# EAGLE design HSNetmeter-simple-v1.1 (EAGLE 8.6.0)
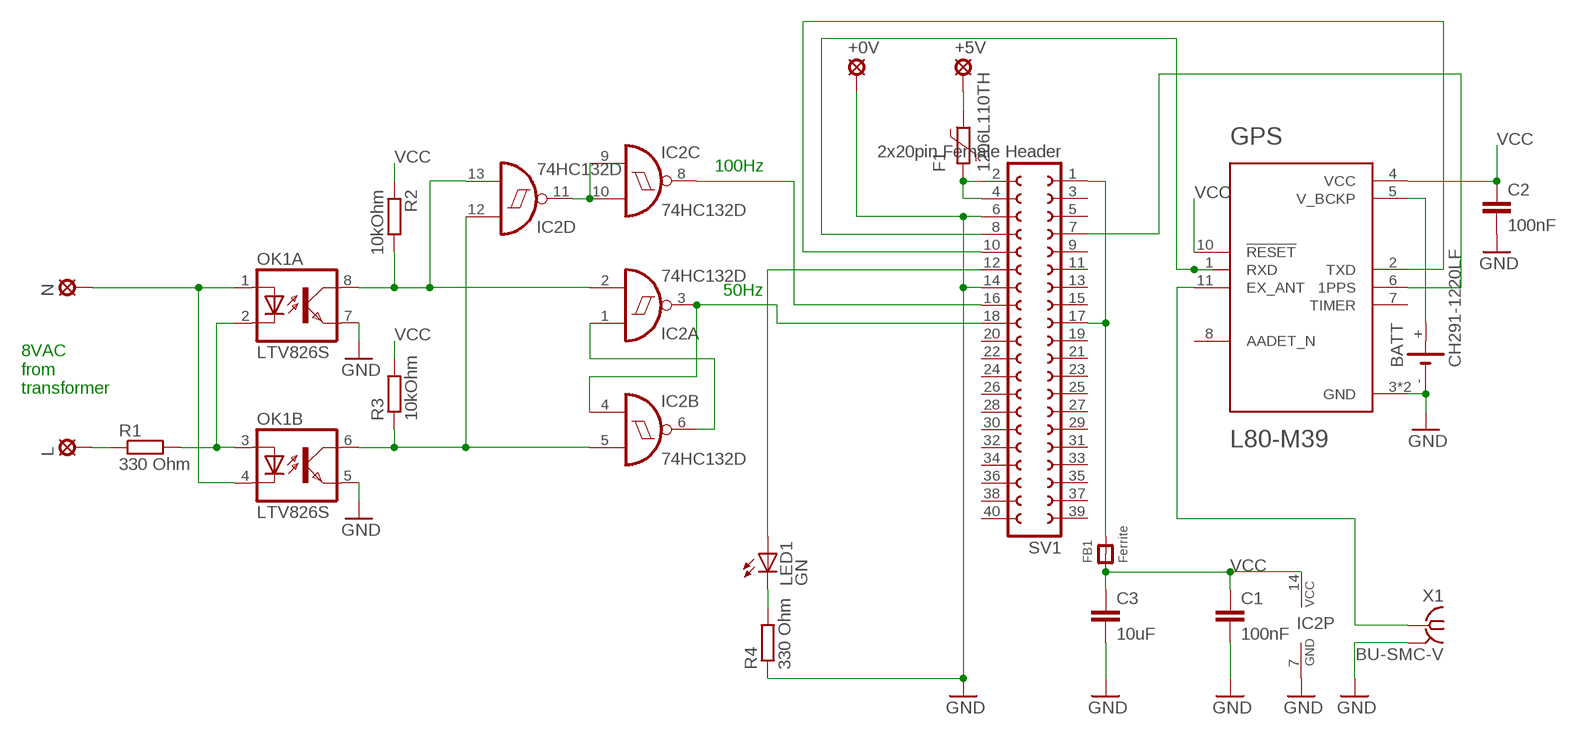
[diagram p0: schematic, sheet 1]

## Parts
+0V  LSP11  [LSP11]
+5V  LSP11  [LSP11]
BATT  CH291-1220LF  [CH291-1220LF]
C1  100nF  C-EUC0805  [C0805]
C2  100nF  C-EUC0805  [C0805]
C3  10uF  C-EUC1206  [C1206]
F1  1206L110TH  [1206L]
FB1  Ferrite  FERRITE0805  [0805]
GPS  L80-M39  [QUECTEL_L80-M39]
IC2  74HC132D  [SO14]
L  LSP11  [LSP11]
LED1  GN  LED3MM  [LED3MM]
N  LSP11  [LSP11]
OK1  LTV826S  [DIL8-SMD]
R1  330 Ohm  R-EU_M0805  [M0805]
R2  10kOhm  R-EU_M0805  [M0805]
R3  10kOhm  R-EU_M0805  [M0805]
R4  330 Ohm  R-EU_M0805  [M0805]
SV1  2x20pin Female Header  FE20-2  [FE20-2]
X1  BU-SMC-V  [BU-SMC-V]

## Nets
+3.3V: FB1.2 SV1.1 SV1.17
GND: +0V.MP BATT.- C1.2 C2.2 C3.2 GPS.3(GND) GPS.12(GND) IC2.7(P:GND) OK1.5(B:EMIT) OK1.7(A:EMIT) R4.1 SV1.6 SV1.14 X1.2 X1.3 X1.4 X1.5
N$1: IC2.8(C:O) SV1.16
N$2: L.MP R1.1
N$3: LED1.K(C) R4.2
N$4: N.MP OK1.1(A:A) OK1.4(B:C)
N$5: F1.2 SV1.2 SV1.4
N$6: +5V.MP F1.1
N$7: LED1.A SV1.12
N$8: GPS.6(1PPS) SV1.7
N$9: OK1.2(A:C) OK1.3(B:A) R1.2
N$10: GPS.1(RXD) SV1.8
N$11: GPS.2(TXD) SV1.10
N$12: IC2.2(A:I1) IC2.13(D:I1) OK1.8(A:COL) R2.2
N$13: IC2.5(B:I1) IC2.12(D:I0) OK1.6(B:COL) R3.1
N$14: IC2.3(A:O) IC2.4(B:I0) SV1.18
N$15: IC2.1(A:I0) IC2.6(B:O)
N$16: IC2.9(C:I0) IC2.10(C:I1) IC2.11(D:O)
N$17: GPS.11(EX_ANT) X1.1
N$18: BATT.+ GPS.5(V_BCKP)
VCC: C1.1 C2.1 C3.1 FB1.1 GPS.4(VCC) GPS.10(!RESET) IC2.14(P:VCC) R2.1 R3.2
Unconnected: GPS.7(TIMER) GPS.8(AADET_N) SV1.3 SV1.5 SV1.9 SV1.11 SV1.13 SV1.15 SV1.19 SV1.20 SV1.21 SV1.22 SV1.23 SV1.24 SV1.25 SV1.26 SV1.27 SV1.28 SV1.29 SV1.30 SV1.31 SV1.32 SV1.33 SV1.34 SV1.35 SV1.36 SV1.37 SV1.38 SV1.39 SV1.40

## Notes on the sheet
- 100Hz
- 50Hz
- 8VAC 
  from 
  transformer

## Library data of the parts
+0V +5V L N = solpad:LSP11: SOLDER PAD drill 1.1 mm
BATT = battery:CH291-1220LF: Battery Holder, SMT, 12mm multicomp PART NO. CH291-1220LF Source: Data sheet <http://www.farnell.com/datasheets/1505860.pdf>
C1-C3 = resistor:C-EU: CAPACITOR, European symbol
F1 = polyfuse-smd_10:?: Polyfuse Resettable PTC Source: http://www.littelfuse.com/products/resettable-ptcs.aspx; MF: Littelfuse; MPN: 1206L110TH; OC_FARNELL: 2383294; OC_NEWARK: 64R8194
FB1 = microbuilder:FERRITE: Ferrite Bead 0603 MMZ1608B121C - 120 Ohm @ 100MHz, 600mA, 0.15 Ohm DC Resistance - Digikey: 445-2164-1-ND BK1608HW121-T - 120 Ohm, 600mA Ferrite Chip - Digikey: 587-1876-2-ND 0805 HZ0805B272R-10 - 2.7K Ohm @ 100MHz, 200mA, 0.8 Ohm DC Resistance - Digikey: 240-2504-1-ND (see also Murata BLM21BD272SN1L) MMZ2012Y152B - 1.5K Ohm @ 100MHz, 500mA, 0.4 Ohm DC Resistance - Digikey: 445-1560-1-ND - Mainly for high frequency (80-400MHz) MMZ2012R102A - 1K Ohm @ 100MHz, 500mA, 0.3 Ohm DC Resistance - Digikey: 445-1555-2-ND - More general purpose (10-200MHz)
GPS = L80-M39:L80-M39: GPS Receiver 1575.42MHz 3.3V 12-Pin; AVAILABILITY: Bad; DESCRIPTION: GPS Receiver 1575.42MHz 3.3V 12-Pin; MF: Quectel; MP: L80-M39; PACKAGE: None; PRICE: 8.97 USD
IC2 = 74xx-eu:74*132: Quad 2-input NAND schmitt trigger
LED1 = led:LED: LED OSRAM: - CHIPLED LG R971, LG N971, LY N971, LG Q971, LY Q971, LO R971, LY R971 LH N974, LH R974 LS Q976, LO Q976, LY Q976 LO Q996 - Hyper CHIPLED LW Q18S LB Q993, LB Q99A, LB R99A - SideLED LS A670, LO A670, LY A670, LG A670, LP A670 LB A673, LV A673, LT A673, LW A673 LH A674 LY A675 LS A676, LA A676, LO A676, LY A676, LW A676 LS A679, LY A679, LG A679 - Hyper Micro SIDELED® LS Y876, LA Y876, LO Y876, LY Y876 LT Y87S - SmartLED LW L88C, LW L88S LB L89C, LB L89S, LG L890 LS L89K, LO L89K, LY L89K LS L896, LA L896, LO L896, LY L896 - TOPLED LS T670, LO T670, LY T670, LG T670, LP T670 LSG T670, LSP T670, LSY T670, LOP T670, LYG T670 LG T671, LOG T671, LSG T671 LB T673, LV T673, LT T673, LW T673 LH T674 LS T676, LA T676, LO T676, LY T676, LB T676, LH T676, LSB T676, LW T676 LB T67C, LV T67C, LT T67C, LS T67K, LO T67K, LY T67K, LW E67C LS E67B, LA E67B, LO E67B, LY E67B, LB E67C, LV E67C, LT E67C LW T67C LS T679, LY T679, LG T679 LS T770, LO T770, LY T770, LG T770, LP T770 LB T773, LV T773, LT T773, LW T773 LH T774 LS E675, LA E675, LY E675, LS T675 LS T776, LA T776, LO T776, LY T776, LB T776 LHGB T686 LT T68C, LB T68C - Hyper Mini TOPLED® LB M676 - Mini TOPLED Santana® LG M470 LS M47K, LO M47K, LY M47K Source: http://www.osram.convergy.de LUXEON: - LUMILED® LXK2-PW12-R00, LXK2-PW12-S00, LXK2-PW14-U00, LXK2-PW14-V00 LXK2-PM12-R00, LXK2-PM12-S00, LXK2-PM14-U00 LXK2-PE12-Q00, LXK2-PE12-R00, LXK2-PE12-S00, LXK2-PE14-T00, LXK2-PE14-U00 LXK2-PB12-K00, LXK2-PB12-L00, LXK2-PB12-M00, LXK2-PB14-N00, LXK2-PB14-P00, LXK2-PB14-Q00 LXK2-PR12-L00, LXK2-PR12-M00, LXK2-PR14-Q00, LXK2-PR14-R00 LXK2-PD12-Q00, LXK2-PD12-R00, LXK2-PD12-S00 LXK2-PH12-R00, LXK2-PH12-S00 LXK2-PL12-P00, LXK2-PL12-Q00, LXK2-PL12-R00 Source: www.luxeon.com KINGBRIGHT: KA-3528ASYC Source: www.kingbright.com
OK1 = optocoupler:LTV826: OPTO COUPLER Source: LITEON, LTV816.pdf; OC_FARNELL: unknown; OC_NEWARK: unknown
R1-R4 = resistor:R-EU_: RESISTOR, European symbol
SV1 = con-lsta:FE20-2: FEMALE HEADER; OC_FARNELL: unknown; OC_NEWARK: unknown
X1 = con-coax:BU-SMC-V: FEMALE SMC CONNECTOR Radiall R112 426 distributor RS 295-5429; OC_FARNELL: unknown; OC_NEWARK: unknown

## Net classes
0 default: width 0.006 mm, clearance 0.254 mm

## Board
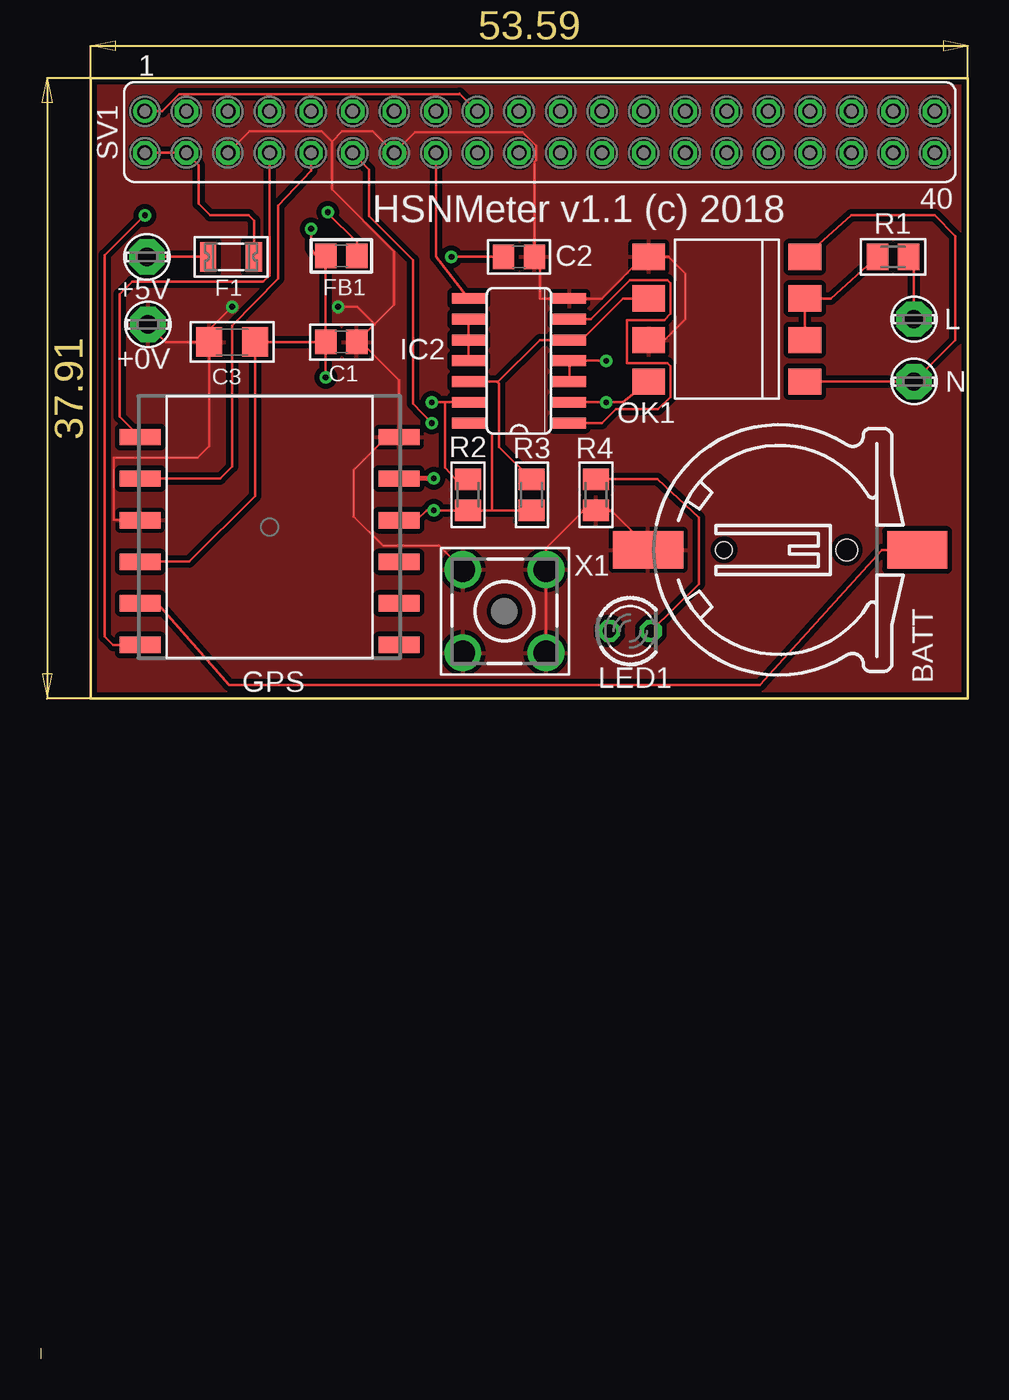
[diagram p1: board, top side]
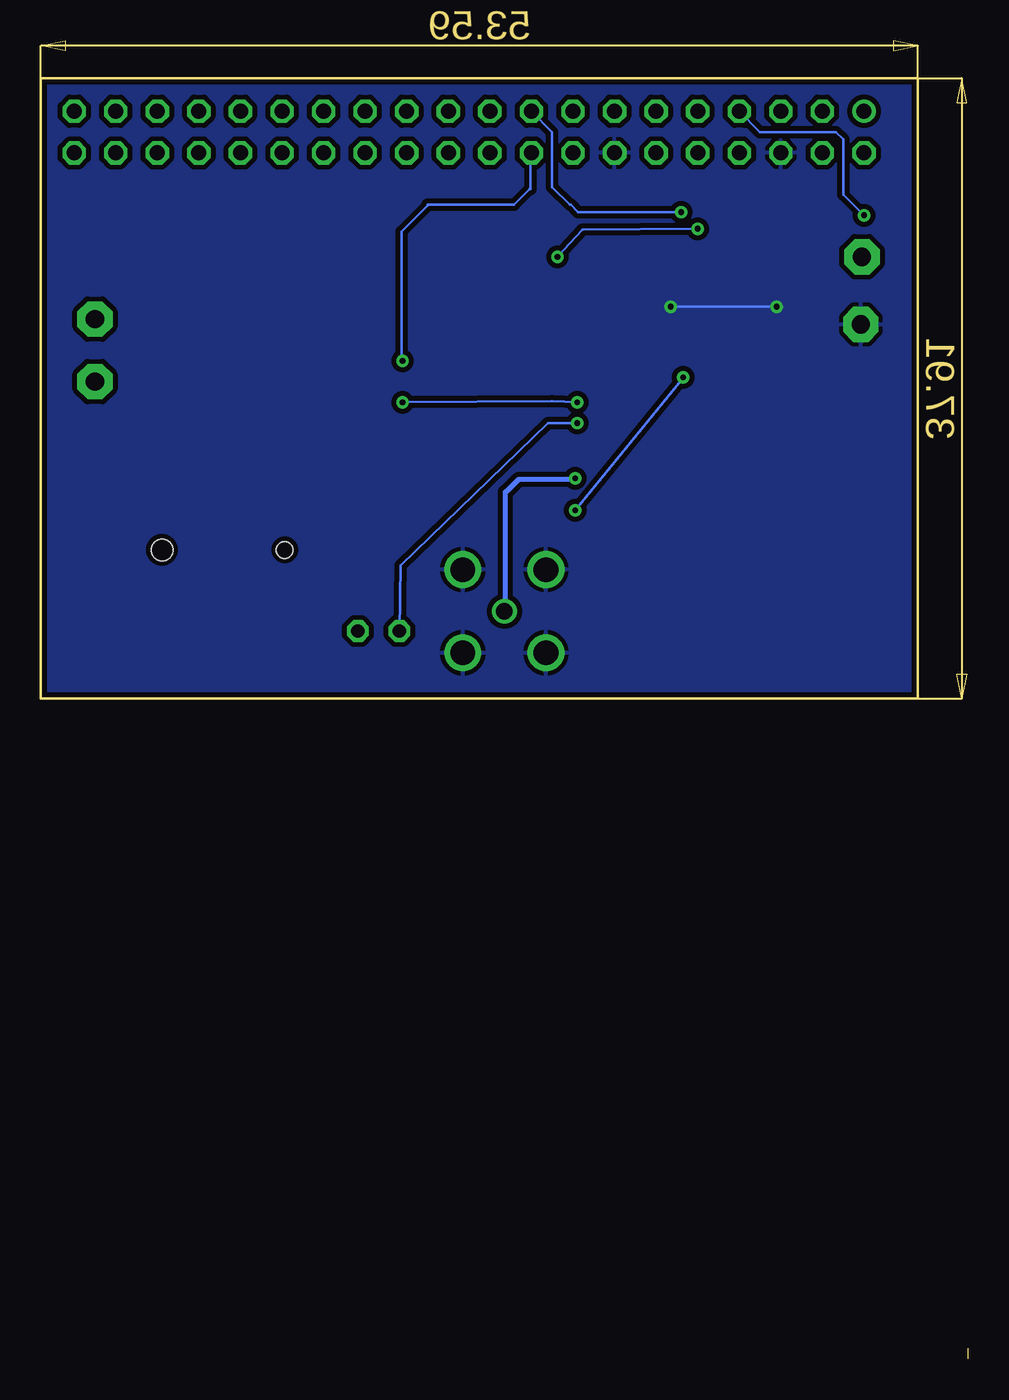
[diagram p2: board, bottom side, seen from below]

Size 56.64 x 78.23 mm. Coordinates in mm from the lower left corner, seen from the top.
Outline: 0,0.64 0,0
Outline: 3.05,78.23 56.64,78.23 56.64,40.32 3.05,40.32 3.05,78.23
Copper layers (1*16): Top 0.035mm / dielectric 1.5mm / Bottom 0.035mm
Design rules "default *": minimum track width 6mil, minimum drill 0.35mm, track to track 6mil, track to pad 6mil, pad to pad 6mil, via to via 6mil, smd to smd 6mil, copper to edge 12mil, drill to drill 6mil, minimum pad ring 10mil, minimum via ring 8mil, stop-mask expansion 4mil, vias tented up to drill 0mil, thermal gap 10mil
tKeepout: area 13.5,50.3 to 14.5,51.3
bKeepout: area 13.5,50.3 to 14.5,51.3

### Footprints (pad centres in the part's own frame; a part is rotated, then mirrored left to right if it is on the bottom)
LSP11 = drill 1.118 pad 2.159 octagon: MP 0,0
CH291-1220LF = smd 2.3 x 3.66: + 0,-2.296 | smd 2.3 x 4.3: - 0,14.146 | hole 1.3: 0,2 | hole 1: 0,9.5
C0805 = smd 1.3 x 1.5: 1 -0.95,0; 2 0.95,0
C1206 = smd 1.6 x 1.8: 1 -1.4,0; 2 1.4,0
1206L = smd 1 x 1.8: 1 -1.4,0; 2 1.4,0
0805 = smd 1.3 x 1.5: 1 -0.95,0; 2 0.95,0
QUECTEL_L80-M39 = smd 2.5 x 1: 1 7.9,-5.5; 2 7.9,-2.96; 3 7.9,-0.42; 4 7.9,2.12; 5 7.9,4.66; 6 7.9,7.2; 7 -7.9,7.2; 8 -7.9,4.66; 9 -7.9,2.12; 10 -7.9,-0.42; 11 -7.9,-2.96; 12 -7.9,-5.5
SO14 = smd 0.66 x 2.032: 1 -3.81,-3.073; 2 -2.54,-3.073; 3 -1.27,-3.073; 4 0,-3.073; 5 1.27,-3.073; 6 2.54,-3.073; 7 3.81,-3.073; 8 3.81,3.073; 9 2.54,3.073; 10 1.27,3.073; 11 0,3.073; 12 -1.27,3.073; 13 -2.54,3.073; 14 -3.81,3.073
LED3MM = drill 0.813 octagon: A -1.27,0; K 1.27,0
DIL8-SMD = smd 1.6 x 2: 1 -3.81,-4.77; 2 -1.27,-4.77; 3 1.27,-4.77; 4 3.81,-4.77; 5 3.81,4.77; 6 1.27,4.77; 7 -1.27,4.77; 8 -3.81,4.77
M0805 = smd 1.3 x 1.6: 1 -0.95,0; 2 0.95,0
FE20-2 = drill 0.914: 1 -24.13,1.27 | drill 0.914 octagon: 2 -24.13,-1.27; 3 -21.59,1.27; 4 -21.59,-1.27; 5 -19.05,1.27; 6 -19.05,-1.27; 7 -16.51,1.27; 8 -16.51,-1.27; 9 -13.97,1.27; 10 -13.97,-1.27; 11 -11.43,1.27; 12 -11.43,-1.27; 13 -8.89,1.27; 14 -8.89,-1.27; 15 -6.35,1.27; 16 -6.35,-1.27; 17 -3.81,1.27; 18 -3.81,-1.27; 19 -1.27,1.27; 20 -1.27,-1.27; 21 1.27,1.27; 22 1.27,-1.27; 23 3.81,1.27; 24 3.81,-1.27; 25 6.35,1.27; 26 6.35,-1.27; 27 8.89,1.27; 28 8.89,-1.27; 29 11.43,1.27; 30 11.43,-1.27; 31 13.97,1.27; 32 13.97,-1.27; 33 16.51,1.27; 34 16.51,-1.27; 35 19.05,1.27; 36 19.05,-1.27; 37 21.59,1.27; 38 21.59,-1.27; 39 24.13,1.27; 40 24.13,-1.27
BU-SMC-V = drill 1.016: 1 0,0 | drill 1.5: 2 -2.54,2.54; 3 2.54,2.54; 4 2.54,-2.54; 5 -2.54,-2.54

### Placement (x,y rotation side)
+0V  6.54,63.18 0 top
+5V  6.48,67.31 0 top
BATT  51.24,49.4 90 top
C1  18.35,62.1 0 top
C2  29.21,67.31 0 top
C3  11.68,62.1 180 top
F1  11.62,67.31 0 top
FB1  18.35,67.37 0 top
GPS  13.97,50.8 180 top
IC2  29.21,60.96 90 top
L  53.34,63.5 0 top
LED1  36,44.45 0 top
N  53.34,59.69 0 top
OK1  41.91,63.5 90 top
R1  52.07,67.31 180 top
R2  26.1,52.77 90 top
R3  29.97,52.77 270 top
R4  33.91,52.77 90 top
SV1  30.48,74.93 0 top
X1  28.32,45.66 0 top

### Tracks (layer width: path | path; a pad name or v marks a point on that pad's centre or on a via)
+3.3V  (via drill 0.35)
  Top 0.152: SV1.1 7.42,76.2 8.46,77.24 25.55,77.24 25.59,77.28 SV1.17 | 17.49,70.01 19.3,68.2 FB1.2 | 17.49,70.01 17.46,70.04 | v17.53,70.04 17.49,70.01
  Bottom 0.152: SV1.17 25.4,74.93 25.4,71.56 24.32,70.48 24.26,70.48 23.81,70.04 v17.53,70.04 17.46,70.04
GND  (via drill 0.35)
  Top 0.152: 5.08,50.8 6.07,50.8 GPS.3 5.04,51.22 4.45,51.24 4.45,55.05 9.59,55.05 10.29,55.75 C3.2 | OK1.7 38.1,62.23 39.37,63.5 39.37,66.29 38.35,67.31 OK1.5 36.83,67.31 34.29,64.77 IC2.7 30.48,64.77 30.48,67.31 C2.2 30.16,73.14 30.25,73.23 30.25,74.09 29.41,74.93 22.86,74.93 SV1.14 20.26,74.99 18.41,74.99 17.78,74.36 | 17.78,74.36 17.78,71.44 21.59,67.63 21.59,64.39 20.38,63.18 | 20.38,63.18 19.43,62.23 | 19.43,62.23 C1.2 | SV1.6 12.76,74.99 17.14,74.99 17.78,74.36 | C3.2 7.62,62.1 +0V.MP | 19.43,62.23 21.87,59.79 GPS.12 21.84,56.33 21.14,56.33 19.11,54.29 19.11,51.44 20.89,49.66 24.32,49.66 X1.2 | 20.38,63.18 19.3,64.26 v18.16,64.26 | 20.38,63.18 | v11.68,64.26 10.29,62.87 10.29,62.17 C3.2 | BATT.- 37.27,49.4 34.86,51.82 R4.1 33.85,51.82 33.15,51.82 30.86,49.53 X1.3 X1.4
  Bottom 0.152: v11.68,64.26 v18.16,64.26
  pour Top (isolate 0.305): 3.05,78.23 56.64,78.23 56.64,40.32 3.05,40.32
  pour Bottom (isolate 0.305): 3.05,78.23 56.64,78.23 56.64,40.32 3.05,40.32
N$1
  Top 0.152: SV1.16 24.13,67.31 IC2.8
N$2
  Top 0.152: L.MP 53.34,67.31 R1.1
N$3
  Top 0.152: R4.2 37.66,53.72 40.2,51.37 40.2,47.31 LED1.K
N$4
  Top 0.152: OK1.1 N.MP 55.88,62.23 55.88,68.58 54.61,69.85 49.53,69.85 OK1.4
N$5
  Top 0.152: SV1.2 SV1.4 9.65,72.9 9.65,70.55 10.35,69.85 12.7,69.85 13.02,69.53 F1.2
N$6
  Top 0.152: +5V.MP F1.1
N$7  (via drill 0.35)
  Top 0.152: SV1.12 20.07,72.64 20.07,69.79 22.73,67.12 22.73,58.36 v23.88,57.15
  Bottom 0.152: v23.88,57.15 25.65,57.15 34.67,48.45 LED1.A
N$8  (via drill 0.35)
  Top 0.152: GPS.6 4.42,43.61 3.91,44.11 3.91,67.41 v6.35,69.85
  Bottom 0.152: SV1.7 12.7,74.93 8.06,74.93 7.62,74.49 7.62,71.12 v6.35,69.85
N$9
  Top 0.152: OK1.2 OK1.3 48.26,64.77 R1.2
N$10
  Top 0.152: SV1.8 13.97,66.17 13.59,65.79 5.59,65.79 4.83,65.02 4.83,57.54 GPS.1
N$11
  Top 0.152: SV1.10 16.51,72.58 14.48,70.42 14.48,65.98 11.68,63.12 11.68,54.48 10.96,53.76 GPS.2
N$12  (via drill 0.35)
  Top 0.152: OK1.8 35.56,58.42 v34.54,58.42 IC2.2 | 24.7,58.42 24.7,54.42 25.34,53.72 R2.2 | 24.7,58.42 v23.88,58.42 | 24.7,58.42 IC2.13
  Bottom 0.152: v34.54,58.42 25.4,58.48 v23.88,58.42
N$13
  Top 0.152: OK1.6 35.56,64.77 33.02,62.23 IC2.5 30.48,62.23 27.94,59.69 | 27.94,59.69 IC2.12 | R3.1 28,55.69 28,59.56 27.94,59.63 27.94,59.69
N$14  (via drill 0.35)
  Top 0.152: IC2.3 IC2.4 v34.54,60.96 34.61,60.96
  Bottom 0.152: SV1.18 26.73,73.6 26.73,71.44 26.8,71.44 27.75,70.48 33.02,70.48 33.02,70.42 34.61,68.83 34.61,60.96 v34.54,60.96
N$15
  Top 0.152: IC2.6 33.6,63.5 36,65.9 38.28,65.9 38.47,65.71 38.47,63.83 38.08,63.45 35.81,63.45 35.81,60.82 38.28,60.82 38.47,60.63 38.47,58.75 37.72,58 35.14,58 34.29,57.15 33.02,57.15 IC2.1
N$16
  Top 0.152: IC2.9 IC2.10 IC2.11
N$17  (via drill 0.35)
  Top 0.305: v24,53.78 21.91,53.78 GPS.11
  Bottom 0.305: X1.1 28.26,45.72 28.26,52.96 28.13,53.02 27.43,53.72 24,53.72 23.88,53.78 v24,53.78
N$18
  Top 0.152: 5.08,45.72 GPS.5 6.1,46.16 7.11,46.16 11.49,41.15 43.94,41.15 51.37,49.4 BATT.+
VCC  (via drill 0.35)
  Top 0.152: C1.1 C3.1 13.08,52.71 9.06,48.68 GPS.4 | v25.08,67.31 28.19,67.31 28.26,67.37 28.32,67.31 C2.1 | v16.51,69.03 16.51,67.82 16.76,67.44 17.4,67.44 FB1.1 17.4,67.31 17.4,62.17 C1.1 | 27.56,51.82 R3.2 | 27.56,51.82 26.16,51.82 R2.1 26.04,51.82 v24,51.82 23.56,51.82 22.99,51.24 21.91,51.24 GPS.10 | 27.56,51.82 27.56,56.45 26.86,57.15 IC2.14 | v17.4,59.94 17.4,62.04 C1.1
  Bottom 0.152: v25.08,67.31 23.56,68.96 v16.51,69.03 | v24,51.82 v17.4,59.94

### Text on the board
tPlace: HSNMeter v1.1 (c) 2018